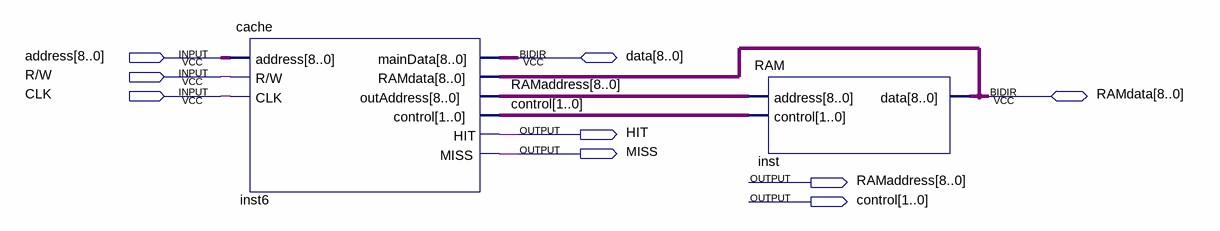
[diagram p0: schematic sheet]
// Quartus schematic LAB.bdf as structural Verilog: 2 symbols, 9 pins
module LAB (
  input  [8:0] address,
  input  \R/W ,
  input  CLK,
  inout  [8:0] data,
  inout  [8:0] RAMdata,
  output HIT,
  output MISS,
  output [8:0] RAMaddress,
  output [1:0] control
);

  cache inst6 (
    .address(address), .\R/W (\R/W ), .CLK(CLK), .outAddress(RAMaddress), .control(control), .HIT(HIT),
    .MISS(MISS), .mainData(data), .RAMdata(RAMdata));
  RAM inst (.address(RAMaddress), .control(control), .data(RAMdata));
endmodule
